# EAGLE schematic quad_comms_v1 (EAGLE 9.6.1)

## Sheet 1 of 2: RF Transceiver
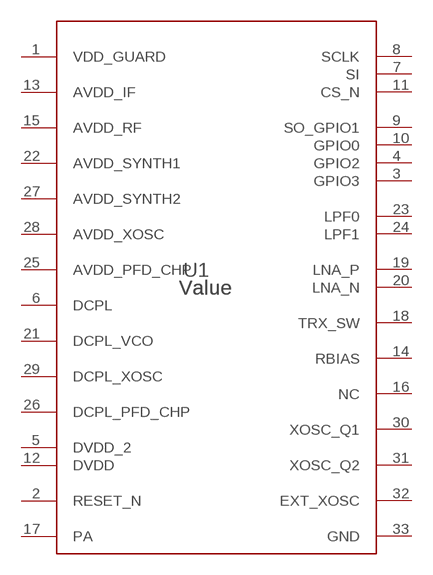
[diagram p0: schematic, sheet 1]

### Parts
U1  Value  CC1200RHBR  [RHB0032E]
Unconnected: U1.2(RESET_N) U1.3(GPIO3) U1.4(GPIO2) U1.7(SI) U1.8(SCLK) U1.9(SO_GPIO1) U1.10(GPIO0) U1.11(CS_N) U1.14(RBIAS) U1.16(NC) U1.17(PA) U1.18(TRX_SW) U1.19(LNA_P) U1.20(LNA_N) U1.23(LPF0) U1.24(LPF1) U1.30(XOSC_Q1) U1.31(XOSC_Q2) U1.32(EXT_XOSC)

## Sheet 2 of 2: GPS
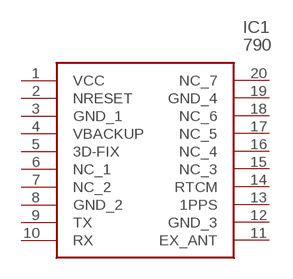
[diagram p1: schematic, sheet 2]

### Parts
IC1  790  [790]
Unconnected: IC1.1(VCC) IC1.2(NRESET) IC1.3(GND_1) IC1.4(VBACKUP) IC1.5(3D-FIX) IC1.6(NC_1) IC1.7(NC_2) IC1.8(GND_2) IC1.9(TX) IC1.10(RX) IC1.11(EX_ANT) IC1.12(GND_3) IC1.13(1PPS) IC1.14(RTCM) IC1.15(NC_3) IC1.16(NC_4) IC1.17(NC_5) IC1.18(NC_6) IC1.19(GND_4) IC1.20(NC_7)

## Power pins joined to a net without a drawn wire
AVDD_IF: U1.13(AVDD_IF)
AVDD_PFD_CHP: U1.25(AVDD_PFD_CHP)
AVDD_RF: U1.15(AVDD_RF)
AVDD_SYNTH1: U1.22(AVDD_SYNTH1)
AVDD_SYNTH2: U1.27(AVDD_SYNTH2)
AVDD_XOSC: U1.28(AVDD_XOSC)
DCPL: U1.6(DCPL)
DCPL_PFD_CHP: U1.26(DCPL_PFD_CHP)
DCPL_VCO: U1.21(DCPL_VCO)
DCPL_XOSC: U1.29(DCPL_XOSC)
DVDD: U1.12(DVDD)
DVDD_2: U1.5(DVDD_2)
GND: U1.33(GND)
VDD_GUARD: U1.1(VDD_GUARD)

## Library data of the parts
IC1 = QUAD:790: GPS Modules Ultimate GPS Module MTK3339 Chipset Source: Datasheet <https://cdn-shop.adafruit.com/datasheets/GlobalTop-FGPMMOPA6H-Datasheet-V0A.pdf>; DESCRIPTION: GPS Modules Ultimate GPS Module MTK3339 Chipset; HEIGHT: 5.2mm; MANUFACTURER_NAME: Adafruit; MANUFACTURER_PART_NUMBER: 790; MOUSER_PART_NUMBER: 485-790; MOUSER_PRICE-STOCK: https://www.mouser.com/Search/Refine.aspx?Keyword=485-790
U1 = QUAD:CC1200RHBR: Sub-GHz Transceiver; ALTERNATE_PARTNUMBER: CC1200RHBT; APPLICATION_BUILDNUMBER: *; COMPTYPE: IC; MANUFACTURER: Texas Instruments; MOUNTTYPE: SMT; PACKAGEREFERENCE: RHB0032E; PARTNUMBER: CC1200RHBR; PIN_COUNT: 33; REFDES: RefDes; ROHS: Y; TYPE: TYPE